# Altium schematic sheet 16 Channels.SchDoc
size A; SheetNumber: 1; SheetTotal: 4
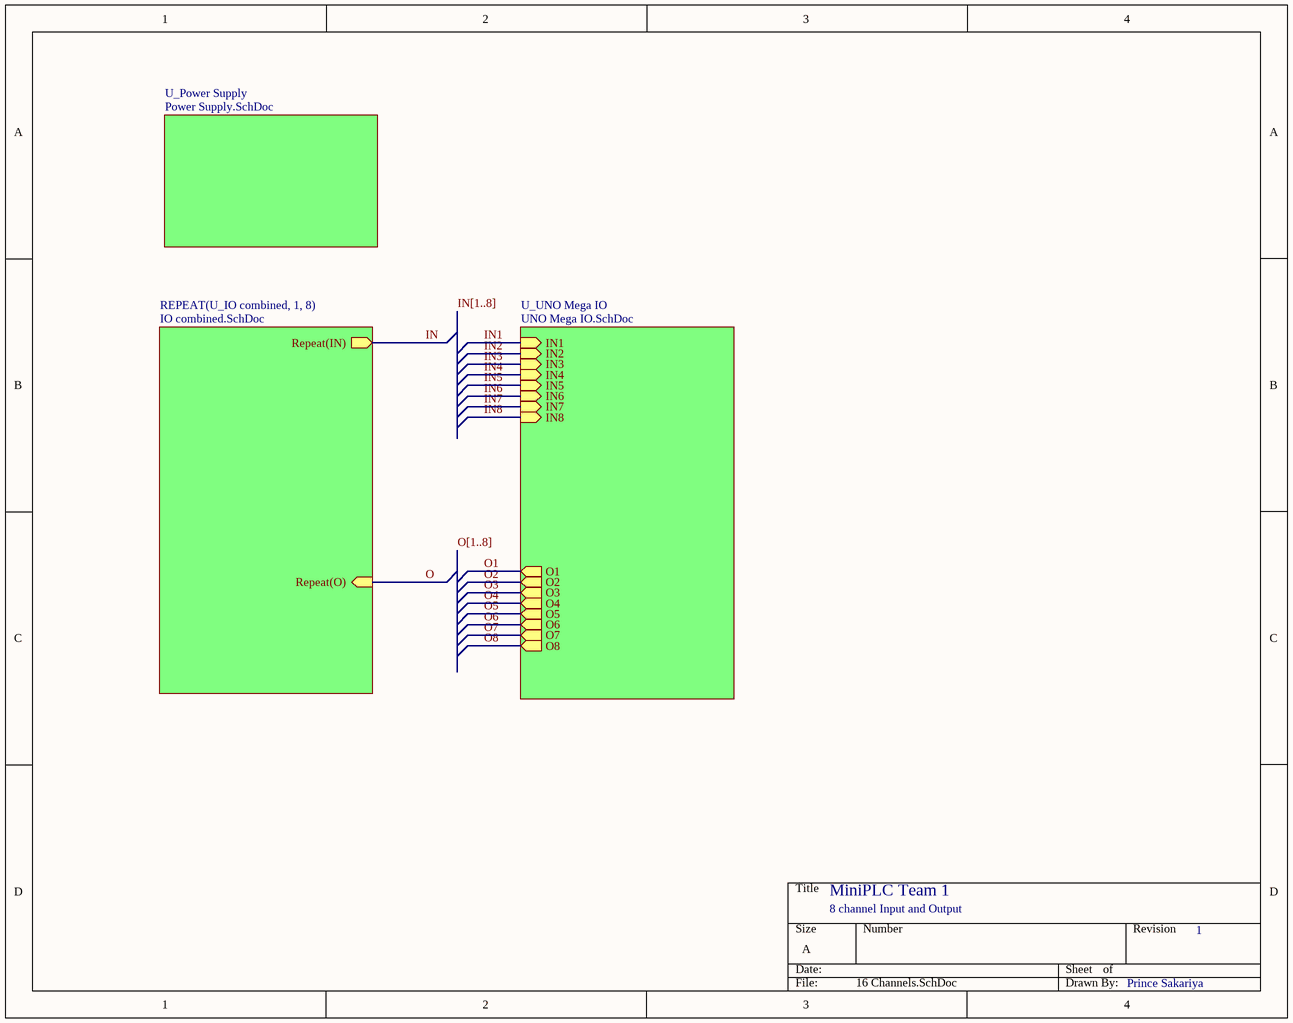
[diagram p0: 16 Channels.SchDoc]

## Sub-sheets
REPEAT(U_IO combined, 1, 8) = IO combined.SchDoc: Repeat(IN) (out), Repeat(O) (in)
U_Power Supply = Power Supply.SchDoc: no entries
U_UNO Mega IO = UNO Mega IO.SchDoc: IN1 (in), IN2 (in), IN3 (in), IN4 (in), IN5 (in), IN6 (in), IN7 (in), IN8 (in), O1 (out), O2 (out), O3 (out), O4 (out), O5 (out), O6 (out), O7 (out), O8 (out)

## Nets
IN: sheet REPEAT(U_IO combined, 1, 8)/Repeat(IN)
IN1: sheet U_UNO Mega IO/IN1
IN2: sheet U_UNO Mega IO/IN2
IN3: sheet U_UNO Mega IO/IN3
IN4: sheet U_UNO Mega IO/IN4
IN5: sheet U_UNO Mega IO/IN5
IN6: sheet U_UNO Mega IO/IN6
IN7: sheet U_UNO Mega IO/IN7
IN8: sheet U_UNO Mega IO/IN8
O: sheet REPEAT(U_IO combined, 1, 8)/Repeat(O)
O1: sheet U_UNO Mega IO/O1
O2: sheet U_UNO Mega IO/O2
O3: sheet U_UNO Mega IO/O3
O4: sheet U_UNO Mega IO/O4
O5: sheet U_UNO Mega IO/O5
O6: sheet U_UNO Mega IO/O6
O7: sheet U_UNO Mega IO/O7
O8: sheet U_UNO Mega IO/O8

## Buses and harness runs
bus IN[1..8]
bus O[1..8]

## Notes on the sheet
- MiniPLC Team 1
- 8 channel Input and Output
- 1
- Prince Sakariya